# Altium project DCAC.PrjPcb (part 5 of 11)
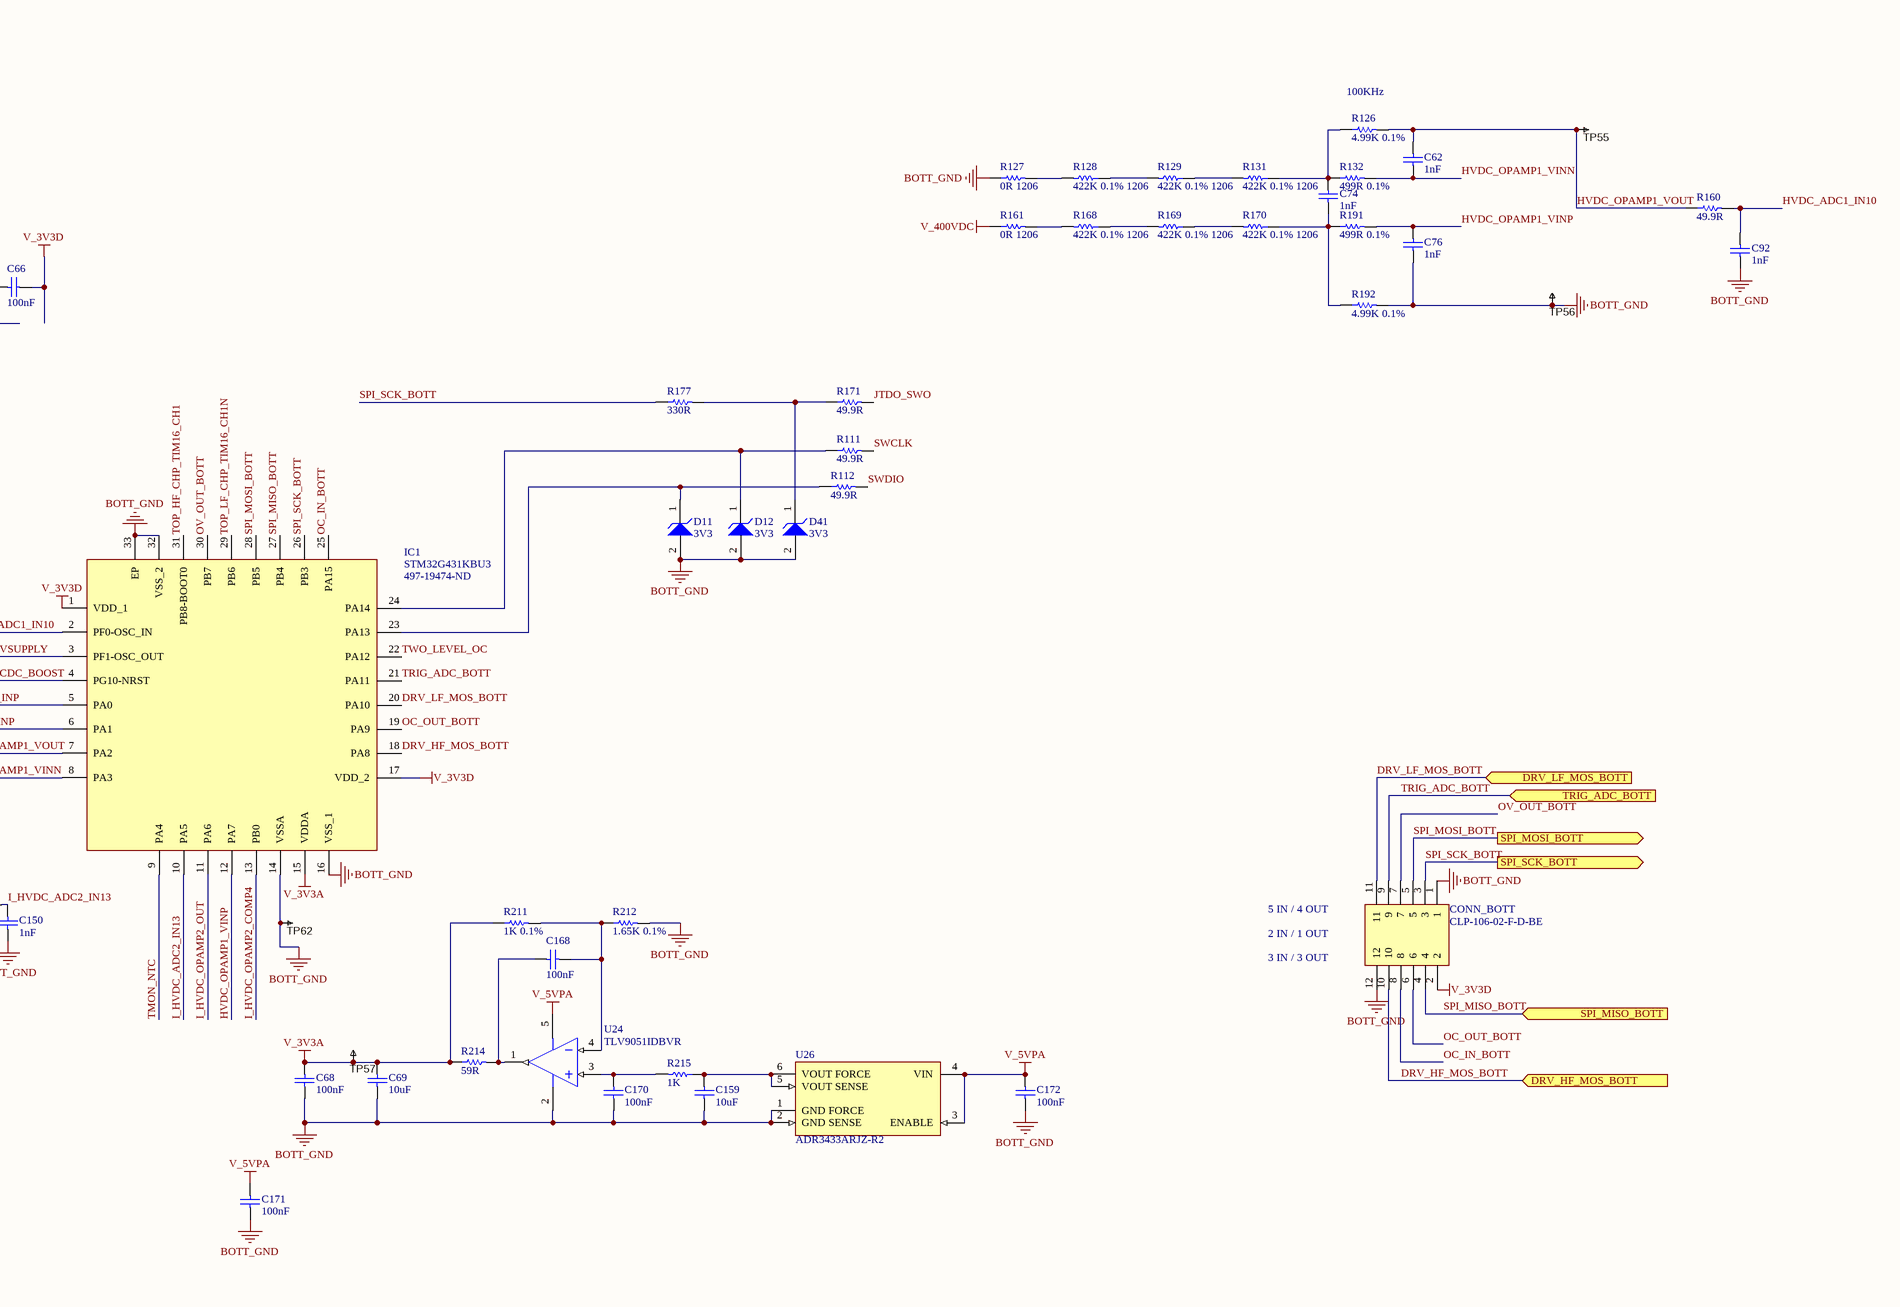
[diagram p15: Control_Sense_BOTT.SchDoc, bottom right]

## Sheet Control_Sense_BOTT.SchDoc (continued)

### Library data of the parts (continued)
R257 = RES-2: Chip Resistor, 0 Ohm, +/- 5%, 0.1 W, -55 to 155 degC, 0603 (1608 Metric), RoHS, Tape and Reel; Manufacturer: Yageo; Manufacturer Part Number: RC0603JR-070RL; Temperature Coefficient: 200ppm/degreesC; Voltage Rating: 50V; Power Rating: 100mW; Resistance: 0mOhm; Width: 0.8mm; Max Operating Temperature: 155degC; Tolerance: 5%; Package Reference: 0603; Height: 0.45mm; Depth: 0.8mm; Package Description: 2-Pin Surface Mount Device, Body 1.6 x 0.8 mm; Termination: SMD/SMT; Package Quantity: 5000; Case/Package: 0603; Case Code (Imperial): 0603; Radiation Hardening: No; Number of Pins: 2; Length: 1.6mm; Lead Free: LeadFree; Voltage Rating (DC): 50V; Military Standard: Not; Datasheet URL: http://www.yageo.com/NewPortal/yageodocoutput?fileName=/pdf/R-Chip/PYu-RC_Group_51_RoHS_L_5.pdf; Manufacturer URL: http://www.yageo.com/; Packaging: TapeandReel; Case Code (Metric): 1608; Min Operating Temperature: -55degC; Composition: ThickFilm; RoHSCompliant: true; Contact Plating: Tin; Datasheet Version: Rev. 5, 10/2016; REACH SVHC: NoSVHC; Supplier 1: Avnet; Supplier Part Number 1: RC0603JR-070RL; RoHS: Yes; Category: Chip SMD Resistors; Stock 1: 1330000; Pricing 1: 5000=0.00138, 10000=0.00136, 20000=0.00132, 30000=0.00129, 40000=0.00124, 50000=0.00121, 500000=0.00118 (USD); Size Code: 0603; Resistor Type: Thick Film; Series: RC; Max Power Dissipation: 100mW; Construction: Rectangular; Number of Terminations: 2; Features: Moisture Resistant; Technology: THICK FILM; Resistance Tolerance: 5%; RoHS Compliant: Yes; ComponentLink1URL: https://datasheet.ciiva.com/11808/pyu-r-int-6-11808700.pdf?src-supplier=RSComponents; ComponentLink1Description: https://datasheet.ciiva.com/11808/pyu-r-int-6-11808700.pdf?src-supplier=RSComponents; ComponentLink2URL: https://datasheet.ciiva.com/22747/443971-22747530.pdf?src-supplier=Element14; ComponentLink2Description: https://datasheet.ciiva.com/22747/443971-22747530.pdf?src-supplier=Element14; ComponentLink3URL: https://datasheet.ciiva.com/12555/rc0603-272842-12555254.pdf?src-supplier=Mouser; ComponentLink3Description: https://datasheet.ciiva.com/12555/rc0603-272842-12555254.pdf?src-supplier=Mouser; ComponentLink4URL: https://datasheet.ciiva.com/7746/1738695-7746421.pdf?src-supplier=Element14; ComponentLink4Description: https://datasheet.ciiva.com/7746/1738695-7746421.pdf?src-supplier=Element14; ComponentLink5URL: https://datasheet.ciiva.com/7746/1738695-7746422.pdf?src-supplier=Element14; ComponentLink5Description: https://datasheet.ciiva.com/7746/1738695-7746422.pdf?src-supplier=Element14; ComponentLink6URL: https://datasheet.ciiva.com/8883/pyu-rc0603-51-rohs-l-4-8883045.pdf?src-supplier=Avnet; ComponentLink6Description: https://datasheet.ciiva.com/8883/pyu-rc0603-51-rohs-l-4-8883045.pdf?src-supplier=Avnet; ComponentLink7URL: https://datasheet.ciiva.com/15189/getdatasheetpartid-329462-15189845.pdf?src-supplier=Verical; ComponentLink7Description: https://datasheet.ciiva.com/15189/getdatasheetpartid-329462-15189845.pdf?src-supplier=Verical
R258 = RES: ±1% ±400ppm/℃ 5.1Ω 0.1W 0603 Chip Resistor - Surface Mount ROHS; Part Number: ERJ3EKF1803V; Manufacturer: Panasonic; Manufacturer Part Number: ERJ-3EKF1803V; Resistance: 180kR; Power Rating: 100mW; Voltage Rating: 75V; Temperature Coefficient: 100ppm/°C; Supplier 1: Digi-Key; Supplier Part Number 1: P180KHCT-ND; RoHS: Yes; Category: Chip SMD Resistors; Stock 1: 113875; Pricing 1: 1=0.10000, 10=0.06100, 100=0.02460, 1000=0.01106, 2500=0.00960 (USD); Mount: Surface Mount; Case/Package: 0603; Case Code (Metric): 1608; Case Code (Imperial): 0603; Contact Plating: Tin; Weight: 7.1E-05oz; Min Operating Temperature: -55°C; Max Operating Temperature: 155°C; Tolerance: 1%; Packaging: Tape and Reel; Resistor Type: Thick Film; Series: ERJ; Package Quantity: 1; Number of Terminations: 2; Termination: SMD/SMT; Max Power Dissipation: 100mW; Voltage Rating (DC): 75V; Construction: Rectangular; Features: Automotive AEC-Q200; Resistance Tolerance: 1%; Length: 1.6mm; Width: 0.031inch; Height: 0.022inch; Depth: 0.8mm; Radiation Hardening: No; RoHS Compliant: Yes; Military Standard: Not; Lead Free: Lead Free; REACH SVHC: No SVHC; ComponentLink1URL: https://datasheet.ciiva.com/22739/426256-22739797.pdf?src-supplier=Element14; ComponentLink1Description: https://datasheet.ciiva.com/22739/426256-22739797.pdf?src-supplier=Element14; ComponentLink2URL: https://datasheet.ciiva.com/24162/aoa0000ce2-24162661.pdf?src-supplier=Mouser; ComponentLink2Description: https://datasheet.ciiva.com/24162/aoa0000ce2-24162661.pdf?src-supplier=Mouser; ComponentLink3URL: https://datasheet.ciiva.com/30137/aoa0000ce2-30137813.pdf?src-supplier=Onlinecomponents.com; ComponentLink3Description: https://datasheet.ciiva.com/30137/aoa0000ce2-30137813.pdf?src-supplier=Onlinecomponents.com; ComponentLink4URL: https://datasheet.ciiva.com/46436/1678782-46436790.pdf?src-supplier=Element14; ComponentLink4Description: https://datasheet.ciiva.com/46436/1678782-46436790.pdf?src-supplier=Element14; ComponentLink5URL: https://datasheet.ciiva.com/46436/1678782-46436791.pdf?src-supplier=Element14; ComponentLink5Description: https://datasheet.ciiva.com/46436/1678782-46436791.pdf?src-supplier=Element14; ComponentLink6URL: https://datasheet.ciiva.com/16782/70260748-16782408.pdf?src-supplier=Allied+Electronics; ComponentLink6Description: https://datasheet.ciiva.com/16782/70260748-16782408.pdf?src-supplier=Allied+Electronics; ComponentLink7URL: https://datasheet.ciiva.com/17207/aoa0000ce2-17207208.pdf?src-supplier=Avnet+Europe; ComponentLink7Description: https://datasheet.ciiva.com/17207/aoa0000ce2-17207208.pdf?src-supplier=Avnet+Europe; ComponentLink8URL: https://datasheet.ciiva.com/28568/1678782-28568699.pdf?src-supplier=Element14; ComponentLink8Description: https://datasheet.ciiva.com/28568/1678782-28568699.pdf?src-supplier=Element14; ComponentLink9URL: https://datasheet.ciiva.com/5915/aoa0000ce2-5915294.pdf?src-supplier=Farnell; ComponentLink9Description: https://datasheet.ciiva.com/5915/aoa0000ce2-5915294.pdf?src-supplier=Farnell; ComponentLink10URL: https://datasheet.ciiva.com/9184/aoa0000ce2-9184911.pdf?src-supplier=Avnet; ComponentLink10Description: https://datasheet.ciiva.com/9184/aoa0000ce2-9184911.pdf?src-supplier=Avnet; Parameter 1: *; JLCPCB Part #: C25197
R262 R263 = CMP-2001-00026-5: ±1% 2kΩ ±100ppm/℃ 0.125W 0805 Chip Resistor - Surface Mount ROHS; Manufacturer: Panasonic; Voltage Rating: 150 V; RoHSCompliant: true; Packaging: Tape and Reel; ComponentLink2Description: Datasheet; DatasheetVersion: 04/2015; Min Operating Temperature: -55 degC; Max Operating Temperature: 155 degC; Mounting Technology: Surface Mount; Length: 2 mm; Package Quantity: 5000; REACH SVHC: Unknown; ComponentLink1URL: http://www.panasonic.com/; ComponentLink2URL: http://industrial.panasonic.com/cdbs/www-data/pdf/RDA0000/AOA0000C86.pdf; Mount: Surface Mount; PackageReference: 0805; ComponentLink1Description: Manufacturer URL; PackageDescription: 2-Pin Surface Mount Device, Body 2 x 1.25 mm; Height: 0.6 mm; JLCPCB Part #: C17604
TP41-TP62 = TESTPOINT: SMD test pin
U3 = TI-LP2951-D8: Single Output LDO, 100 mA, 1.2 to 29 V Output, 2 to 30 V Input, -40 to 125 degC, 8-Pin SOIC (D), RoHS, Tape and Reel; Manufacturer: Texas Instruments; Iq (Typ) (mA): 0.075; Output Options: Adjustable Output; Output Capacitor Type: Non-Ceramic; Vdo (Typ) (mV): 380; Vin (Max) (V): 30; Vout (Min) (V): 1.2; Vin (Min) (V): 2; Rating: Catalog; Accuracy (%): 1.4; Iout (Max) (A): 0.1; Vout (Max) (V): 29; ComponentLink1URL: http://www.ti.com/; PackageReference: D0008A; Operating Temperature Range (C): -40 to 125; ComponentLink3Description: Package Specification; ComponentLink1Description: Manufacturer URL; ComponentLink2URL: http://www.ti.com/lit/ds/symlink/lp2950-30.pdf; DatasheetVersion: SLVS582H; ComponentLink2Description: Datasheet; RoHS: TRUE; Packing: Tape and Reel; PartNumber: LP2951DR; PackageVersion: 4040047-3/M; Mounting Technology: Surface Mount; PackageDescription: 8-Pin Plastic Small Outline, Body 3.9 x 4.9 mm, Pitch 1.27 mm; ComponentLink3URL: http://www.ti.com/lit/ml/msoi002j/msoi002j.pdf
U6 U7 = CMP-0366-01377-2: Adjustable Precision Shunt Regulator, 34 ppm / degC, 100 mA, -40 to 85 degC, 3-pin SOT-89 (PK), Green (RoHS & no Sb/Br); Manufacturer: Texas Instruments; Rating: Military; SubFamily: Shunt Voltage Reference; Min Iz for Regulation(uA): 600; Initial Accuracy @ 25/deg C(%): 2; Temp Coeff(Typ)(ppm/ degree C): 34; Temp Coeff(Max)(ppm/ degree C): 92; VO Adj(Min)(V): 2.495; Iout/Iz(Max)(mA): 100; VO Adj(Max)(V): 36; Eco-Plan: Green (RoHS & no Sb/Br); Code_JEDEC: TO-243; DatasheetVersion: SLVS543M; ComponentLink1URL: http://www.ti.com/; PackageReference: PK0003A; PackageDescription: 3-Pin Plastic Small Outline, Body 2.5 x 4.5 mm, Pitch 1.5 mm; PackageVersion: 4040234/D; ComponentLink3URL: http://www.ti.com/litv/pdf/mhsi001b; PartNumber: TL431IPK; ComponentLink3Description: Package Specification; ComponentLink2URL: http://www.ti.com/general/docs/lit/getliterature.tsp?genericPartNumber=TL431&fileType=pdf; Mounting Technology: Surface Mount; ComponentLink2Description: Datasheet; ComponentLink1Description: Manufacturer URL
U10 U15 = CMP-0859-00394-3: Single 2-Input Positive-AND Gate, DCK0005A, SMALL T&R; Generic Part Number: SN74AHC1G08; Manufacturer: Texas Instruments; Schmitt Trigger: No; ICC @ Nom Voltage(Max)(mA): 0.01; Technology Family: AHC; Output Drive (IOL/IOH)(Max)(mA): 50/-50; tpd @ Nom Voltage(Max)(ns): 12.3,7.9; Logic: True; Gate Type: AND; VCC(Min)(V): 2; Input Type: CMOS; Voltage(Nom)(V): 3.3,5; Bits(#): 1; VCC(Max)(V): 5.5; F @ Nom Voltage(Max)(Mhz): 75; Rating: Catalog; 3-State Output: No; Operating Temperature Range(C): -55 to 125; DatasheetVersion: SCLS314N; Sub-Family: AND Gate; Output Type: CMOS; PackageReference: DCK0005A
U11 U16 = CMP-0859-00258-3: Single Bus Buffer Gate With 3-State Output, DCK0005A, LARGE T&R; Manufacturer: Texas Instruments; Bits(#): 1; 3-State Output: Yes; Input Type: CMOS; VCC(Min)(V): 2; Schmitt Trigger: No; Rating: Catalog; tpd @ Nom Voltage(Max)(ns): 6; Voltage(Nom)(V): 5; Technology Family: AHCT; ICC @ Nom Voltage(Max)(mA): 0.01; Output Drive (IOL/IOH)(Max)(mA): 8/-8; Sub-Family: Non-Inverting Buffer/Driver; VCC(Max)(V): 5.5; F @ Nom Voltage(Max)(Mhz): 75; Logic: True; Generic Part Number: SN74AHCT1G126; Operating Temperature Range(C): -40 to 125; Output Type: CMOS; PackageReference: DCK0005A; DatasheetVersion: SCLS380J
U14 = PM-LINEREG-TC1014-IL5: 50 mA, 100 mA and 150 mA CMOS LDOs with Active-Low Shutdown and Reference Bypass, 5-Pin SOT-23, Extended Temperature, Tape and Reel; PackageVersion: revBB, Aug-2009; Code_IPC: SOT23-5; PackageDescription: 5-Lead Plastic Small Outline Transistor (CT) [SOT-23]; DatasheetVersion: revE, Feb-2007; PackageReference: SOT-23-CT5
U23 = PM-CHP-LM2661M-8: Switched Capacitor Voltage Converter, 8-pin Narrow SOIC, Pb-Free; Manufacturer: Texas Instruments; PackageTopMarking: NSZXTT*LM26*63M; CompType: Switch Caps; PowerWise: N; Code_IPC: SOIC127P600-8; PinCount: 8; ComponentLink1Description: Datasheet URL; PackageReference: D0008A; Code_JEDEC: MS-012-AA; PackageDescription: SOIC Narrow, 4.9 x 3.9 x 1.45mm, 8 Lead, 1.27mm Pitch; ComponentLink1URL: http://www.ti.com/general/docs/lit/getliterature.tsp?genericPartNumber=LM2663&fileType=pdf; RoHS: Y
U24 U34 = CMP-0187-00454-2: 2.8 MHz, 150 Î¼A Op Amp, 5-Pin SOT-23, Extended Temperature Range, Tape and Reel; Code_IPC: SOT23-5; PackageDescription: 5-Lead Plastic Small Outline Transistor (OT) [SOT-23]; PackageReference: SOT-23-OT5; ComponentLink3URL: http://www.microchip.com/stellent/groups/techpub_sg/documents/packagingspec/en012702.pdf; ComponentLink1Description: Manufacturer URL; ComponentLink2URL: http://ww1.microchip.com/downloads/en/DeviceDoc/22145a.pdf; ComponentLink2Description: Datasheet; PackageVersion: revBB, Aug-2009; RevisionNote: URLs added.; ComponentLink1URL: http://www.microchip.com/; DatasheetVersion: revA, Mar-2009; ComponentLink3Description: Package Specification
U26 = ADI-ADR34xx-RJ-6: Micropower, High Accuracy Voltage Reference, 3.3 V Output, 3.5 to 5.5 V Supply, Industrial, 6-pin SOT23 (RJ-6), Reel; Manufacturer: Analog Devices; Ref Out TC (ppm/C): 8; Vout: 3.3V; Min V Supply (V): 3.5; Max V Supply (V): 5.5; PartNumber: ADR3433ARJZ-R2; Mounting Technology: Surface Mount; ComponentLink1URL: http://www.analog.com/en/index.html; ComponentLink1Description: Manufacturer URL; PackageVersion: 121608-A, 12/2008; Operating Temp Range: -40 to 125 degC; Packing: Reel; ComponentLink2Description: Datasheet; PackageDescription: 6-Pin Small Outline Transistor Package, Body 2.9 x 1.6 mm, Pitch 0.95 mm; ComponentLink4Description: URL Link1; ComponentLink3Description: Package Specification; Code_JEDEC: MO-178-AB; DatasheetVersion: Rev. B; PackageReference: RJ-6; ComponentLink4URL: Product URL:http://www.analog.com/en/special-linear-functions/voltage-references/adr3433/products/product.html; ComponentLink3URL: http://www.analog.com/static/imported-files/packages/PKG_PDF/SOT-23(RJ)/RJ_6.pdf; ComponentLink2URL: http://www.analog.com/static/imported-files/data_sheets/ADR3412_ADR3420_ADR3425_ADR3430_ADR3433_ADR3440_ADR3450.pdf
U35 U36 = 1EDN8550B: Single-channel EiceDRIVER™ with true  differential inputs
U37 = CMP-0366-01210-2: Adjustable Precision Shunt Regulator, 34 ppm / degC, 100 mA, -40 to 125 degC, 3-pin SOT-23 (DBZ), Green (RoHS & no Sb/Br); Manufacturer: Texas Instruments; Iout/Iz(Max)(mA): 100; Min Iz for Regulation(uA): 600; SubFamily: Shunt Voltage Reference; Temp Coeff(Typ)(ppm/ degree C): 34; VO Adj(Max)(V): 36; Rating: Catalog; Initial Accuracy @ 25/deg C(%): 1; VO Adj(Min)(V): 2.495; Temp Coeff(Max)(ppm/ degree C): 92; PackageReference: DBZ0003A; ComponentLink1Description: Manufacturer URL; Mounting Technology: Surface Mount; ComponentLink2URL: http://www.ti.com/general/docs/lit/getliterature.tsp?genericPartNumber=TL431A&fileType=pdf; PackageVersion: 4203227/B; ComponentLink2Description: Datasheet; PackageDescription: 3-Pin Plastic Small Outline, Body 2.92 x 1.3 mm, Pitch 0.95 mm; ComponentLink1URL: http://www.ti.com/; Eco-Plan: Green (RoHS & no Sb/Br); Code_JEDEC: TO-236; ComponentLink3URL: http://www.ti.com/litv/pdf/mpds108a; DatasheetVersion: SLVS543M; ComponentLink3Description: Package Specification; PartNumber: TL431AQDBZR
U40 = LM51571QRTERQ1: Integrated Circuit; Manufacturer_Name: Texas Instruments; Datasheet Link: https://www.ti.com/lit/ds/symlink/lm51571-q1.pdf?ts=1617256844020&ref_url=https%253A%252F%252Fwww.ti.com%252Fstore%252Fti%252Fen%252Fp%252Fproduct%252F%253Fp%253DLM51571QRTERQ1; Height: 0.8mm; Manufacturer_Part_Number: LM51571QRTERQ1; Mouser Part Number: 595-LM51571QRTERQ1; Mouser Price/Stock: https://www.mouser.co.uk/ProductDetail/Texas-Instruments/LM51571QRTERQ1?qs=DRkmTr78QATLeGZjuFYyEQ%3D%3D; Arrow Part Number: LM51571QRTERQ1; Arrow Price/Stock: https://www.arrow.com/en/products/lm51571qrterq1/texas-instruments?region=nac

## Sheet IND_CURRENT_SENSE.SchDoc
size A2 portrait; SheetNumber: 2; SheetTotal: 4
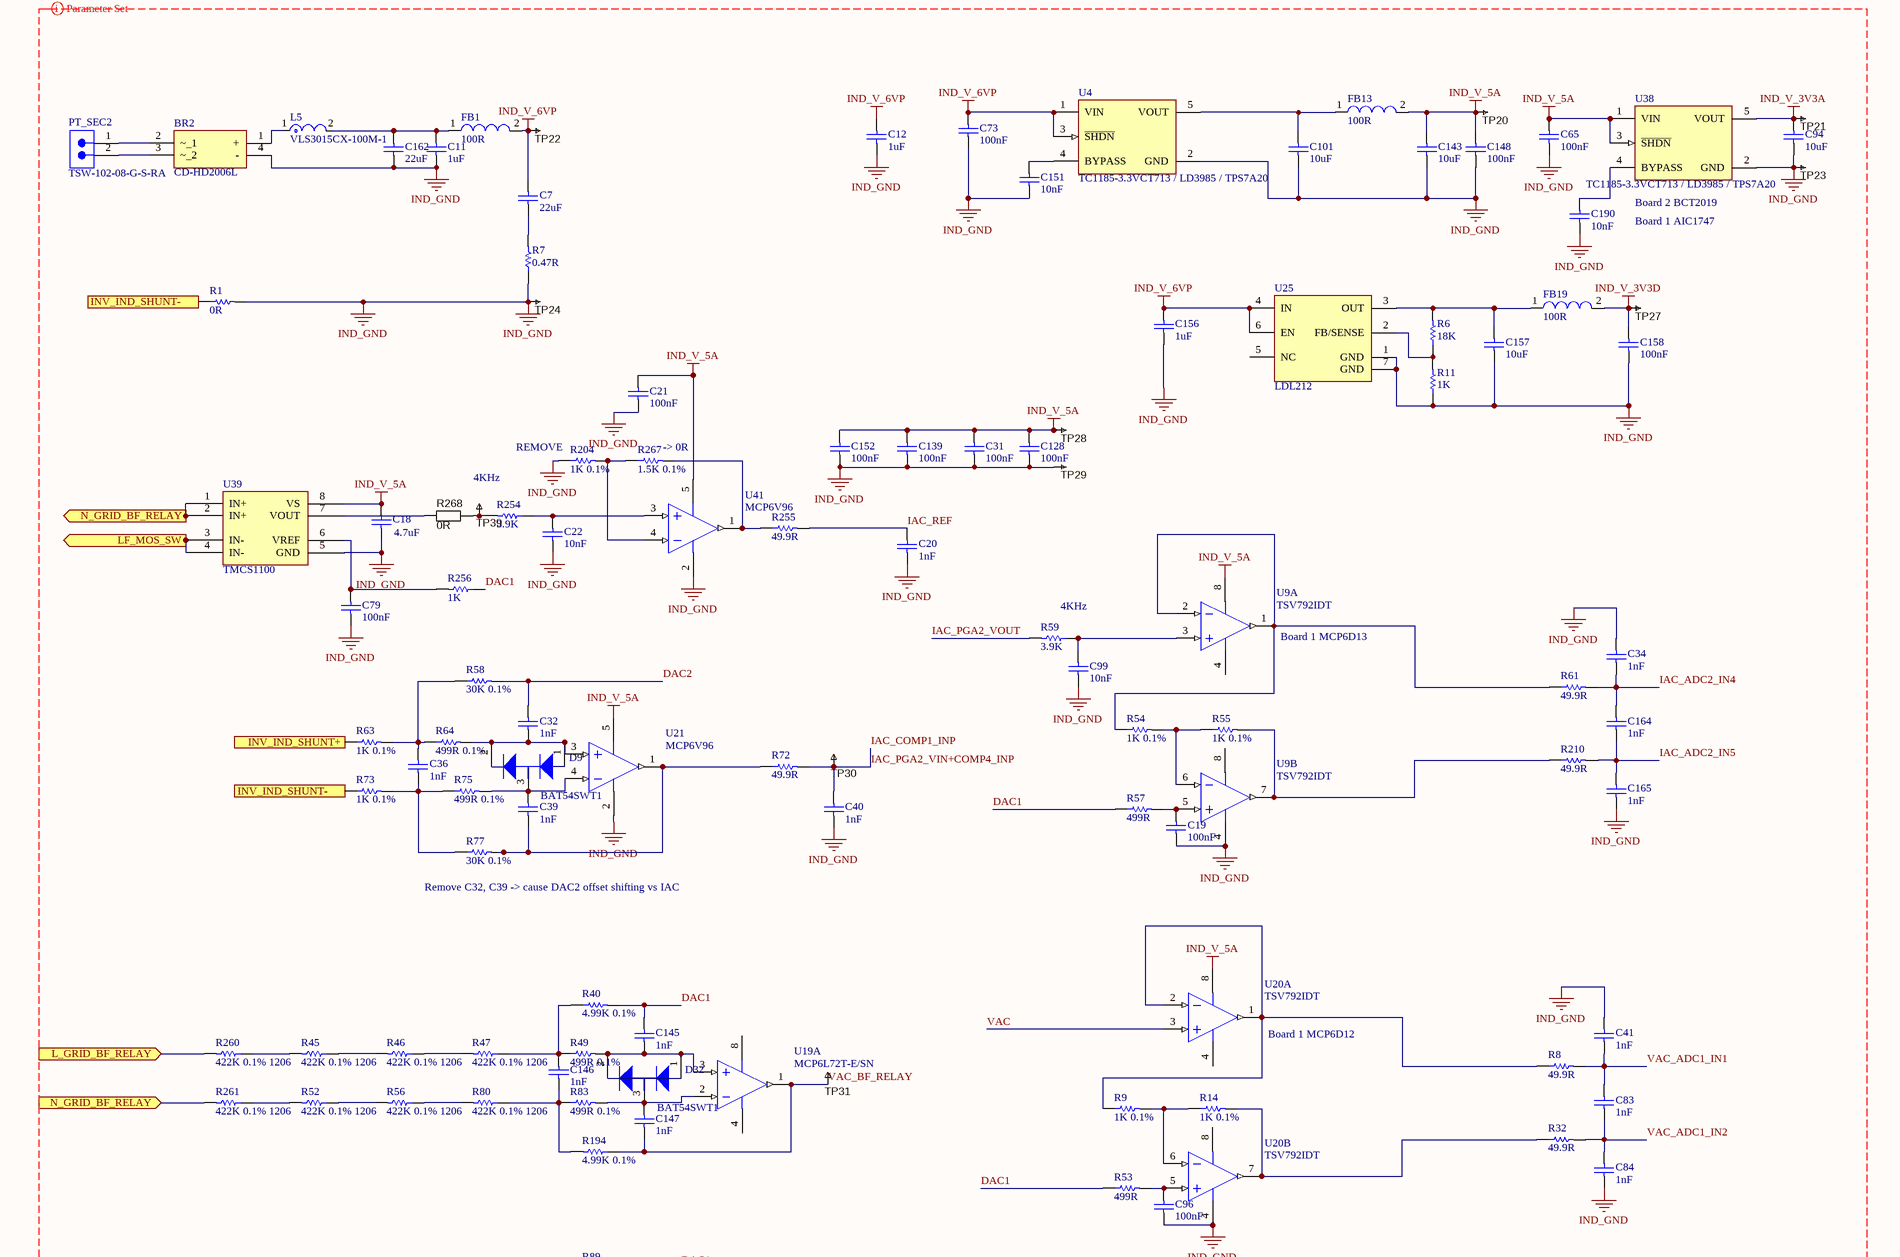
[diagram p6: IND_CURRENT_SENSE.SchDoc, top]
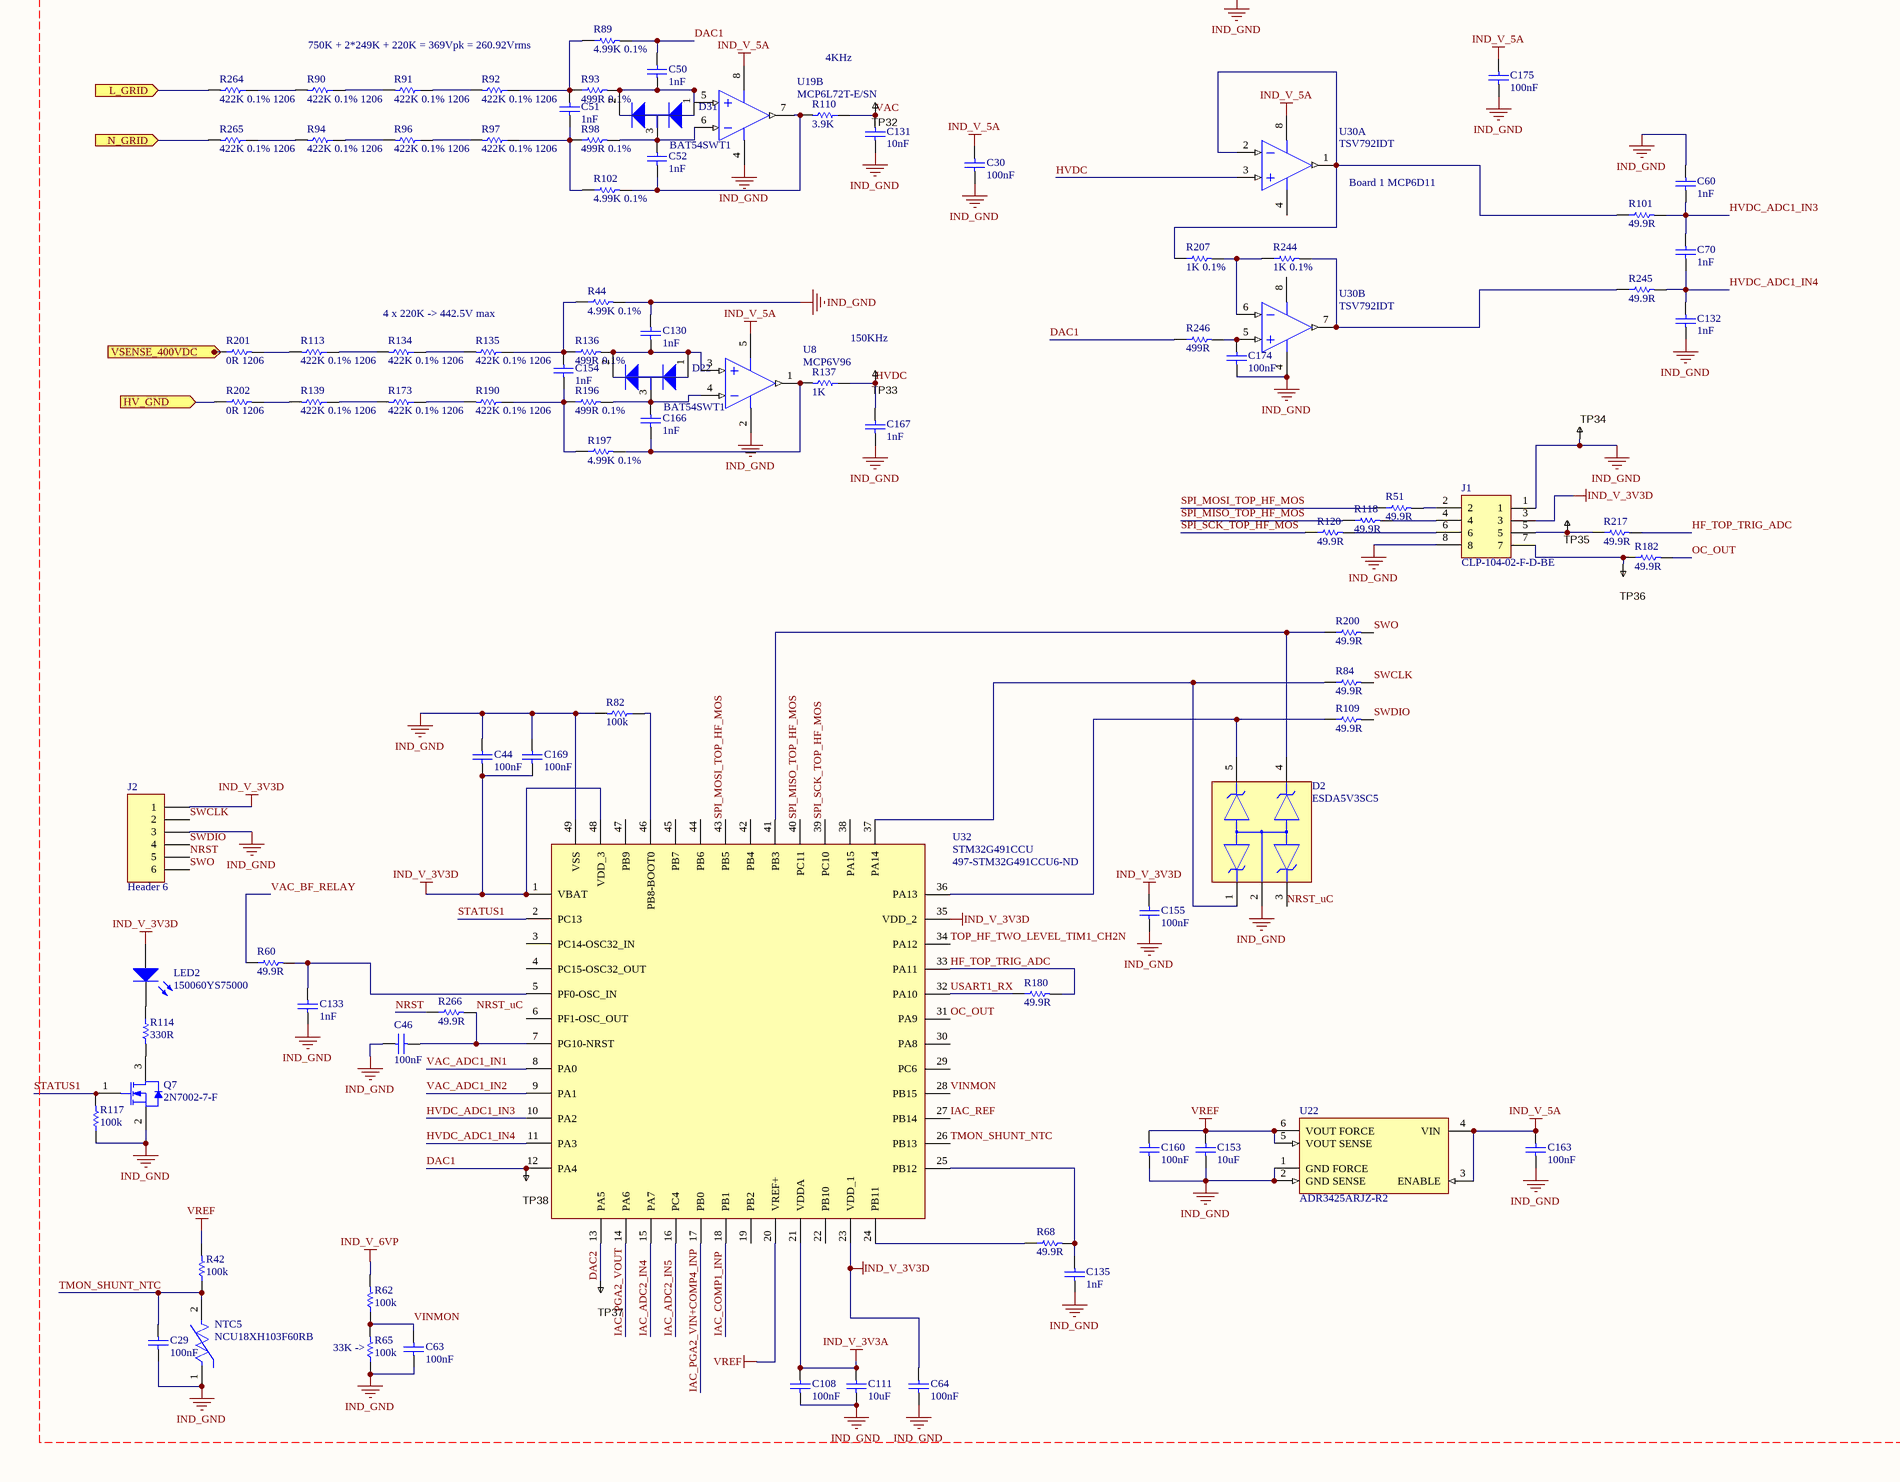
[diagram p7: IND_CURRENT_SENSE.SchDoc, bottom]

### Parts
BR2  CD-HD2006L  [CDHD2006L]
C7  22uF  [CAPC1206(3216)190_N]
C11  1uF  [CAPC1608X86X35NL15T15]
C12  1uF  [CAPC1608X86X35NL15T15]
C18  Capacitance: 4.7uF  [CAPC3216X180X50NL20T25]  (hidden comment: C1206C105K3RACTU)
C19  100nF  [CAPC1608X90X35NL10T15]
C20  1nF  [CAPC1005X56X25NL10T15]
C21  100nF  [CAPC1608X90X35NL10T15]
C22  10nF  [CAPC1608X90X35NL10T15]
C29  100nF  [CAPC1005X56X25NL10T15]
C30  100nF  [CAPC1608X90X35NL10T15]
C31  100nF  [CAPC1608X90X35NL10T15]
C32  1nF  [CAPC1608X90X35NL15T15]
C34  1nF  [CAPC1005X56X25NL10T15]
C36  1nF  [CAPC1608X90X35NL15T15]
C39  1nF  [CAPC1608X90X35NL15T15]
C40  1nF  [CAPC1005X56X25NL10T15]
C41  1nF  [CAPC1005X56X25NL10T15]
C44  100nF  [CAPC1608X90X35NL10T15]
C46  100nF  [CAPC1005X56X25NL10T15]
C50  1nF  [CAPC1608X90X35NL15T15]
C51  1nF  [CAPC1608X90X35NL15T15]
C52  1nF  [CAPC1608X90X35NL15T15]
C60  1nF  [CAPC1005X56X25NL10T15]
C63  100nF  [CAPC1005X56X25NL10T15]
C64  100nF  [CAPC1005X56X25NL10T15]
C65  100nF  [CAPC1608X90X35NL10T15]
C70  1nF  [CAPC1005X56X25NL10T15]
C73  100nF  [CAPC1608X90X35NL10T15]
C79  100nF  [CAPC1608X90X35NL10T15]
C83  1nF  [CAPC1005X56X25NL10T15]
C84  1nF  [CAPC1005X56X25NL10T15]
C94  10uF  [CAPC1608X90X40NL10T20]
C96  100nF  [CAPC1608X90X35NL10T15]
C99  10nF  [CAPC1608X90X35NL10T15]
C101  10uF  [CAPC2013X140X45NL15T25]
C108  100nF  [CAPC1005X56X25NL10T15]
C111  10uF  [CAPC1608X90X40NL10T20]
C128  100nF  [CAPC1608X90X35NL10T15]
C130  1nF  [CAPC1608X90X35NL15T15]
C131  10nF  [CAPC1608X90X35NL10T15]
C132  1nF  [CAPC1005X56X25NL10T15]
C133  1nF  [CAPC1005X56X25NL10T15]
C135  1nF  [CAPC1005X56X25NL10T15]
C139  100nF  [CAPC1608X90X35NL10T15]
C143  10uF  [CAPC2013X140X45NL15T25]
C145  1nF  [CAPC1608X90X35NL15T15]
C146  1nF  [CAPC1608X90X35NL15T15]
C147  1nF  [CAPC1608X90X35NL15T15]
C148  100nF  [CAPC1608X90X35NL10T15]
C151  10nF  [CAPC1608X90X35NL10T15]
C152  100nF  [CAPC1608X90X35NL10T15]
C153  10uF  [CAPC1608X90X40NL10T20]
C154  1nF  [CAPC1608X90X35NL15T15]
C155  100nF  [CAPC1608X90X35NL10T15]
C156  1uF  [CAPC1608X86X35NL15T15]
C157  10uF  [CAPC1608X90X40NL10T20]
C158  100nF  [CAPC1608X90X35NL10T15]
C160  100nF  [CAPC1005X56X25NL10T15]
C162  22uF  [CAPC1206(3216)190_N]
C163  100nF  [CAPC1608X90X35NL10T15]
C164  1nF  [CAPC1005X56X25NL10T15]
C165  1nF  [CAPC1005X56X25NL10T15]
C166  1nF  [CAPC1608X90X35NL15T15]
C167  1nF  [CAPC1608X90X35NL15T15]
C169  100nF  [CAPC1608X90X35NL10T15]
C174  100nF  [CAPC1608X90X35NL10T15]
C175  100nF  [CAPC1608X90X35NL10T15]
C190  10nF  [CAPC1608X90X35NL10T15]
D2  ESDA5V3SC5  [FP-SOT323-5L-MFG]
D9  BAT54SWT1  [ONSC-SOT-323-3-419-04_V]
D22  BAT54SWT1  [ONSC-SOT-323-3-419-04_V]
D31  BAT54SWT1  [ONSC-SOT-323-3-419-04_V]
D32  BAT54SWT1  [ONSC-SOT-323-3-419-04_V]
FB1  100R  [SMD-0603]
FB13  100R  [SMD-0603]
FB19  100R  [SMD-0603]
J1  CLP-104-02-F-D-BE  [CLP-104-02-XXX-D-BE]
J2  Header 6  [HDR1X6]
L5  VLS3015CX-100M-1  [FP-VLS3015CX-H-MFG]
LED2  150060YS75000  [0603_A]
NTC5  NCU18XH103F60RB  [FP-NCU18-0_15-MFG]
PT_SEC2  TSW-102-08-G-S-RA  [SMTC-TSW-102-08-X-S-RA]
Q7  2N7002-7-F  [DIOD-SOT23-3_V]
R1  0R  [RESC1608X55X25ML10T15]
R6  18K  [RESC1608X55X30NL20T20]
R7  0.47R  [RESC1608X55X25NL10T15]
R8  49.9R  [RESC1005X40X25NL05T05]
R9  1K 0.1%  [RESC1608X55X25NL10T15]
R11  1K  [RESC1608X55X30NL15T15]
R14  1K 0.1%  [RESC1608X55X25NL10T15]
R32  49.9R  [RESC1005X40X25NL05T05]
R40  4.99K 0.1%  [RESC1608X55X30NL20T20]
R42  100k  [RESC1608X55X30NL15T15]
R44  4.99K 0.1%  [RESC1608X55X30NL20T20]
R45  422K 0.1% 1206  [RESC1206(3216)_N]
R46  422K 0.1% 1206  [RESC1206(3216)_N]
R47  422K 0.1% 1206  [RESC1206(3216)_N]
R49  499R 0.1%  [RESC1608X55X30LL20T20]
R51  49.9R  [RESC1005X40X25NL05T05]
R52  422K 0.1% 1206  [RESC1206(3216)_N]
R53  499R  [RESC1608X55X25NL10T15]
R54  1K 0.1%  [RESC1608X55X25NL10T15]
R55  1K 0.1%  [RESC1608X55X25NL10T15]
R56  422K 0.1% 1206  [RESC1206(3216)_N]
R57  499R  [RESC1608X55X25NL10T15]
R58  30K 0.1%  [RESC1608X55N]
R59  3.9K  [RESC1608X55X30NL15T15]
R60  49.9R  [RESC1005X40X25NL05T05]
R61  49.9R  [RESC1005X40X25NL05T05]
R62  100k  [RESC1608X55X30NL15T15]
R63  1K 0.1%  [RESC1608X55X25NL10T15]
R64  499R 0.1%  [RESC1608X55N]
R65  100k  [RESC1608X55X30NL15T15]
R68  49.9R  [RESC1005X40X25NL05T05]
R72  49.9R  [RESC1005X40X25NL05T05]
R73  1K 0.1%  [RESC1608X55X25NL10T15]
R75  499R 0.1%  [RESC1608X55N]
R77  30K 0.1%  [RESC1608X55N]
R80  422K 0.1% 1206  [RESC1206(3216)_N]
R82  100k  [RESC1608X55X30NL15T15]
R83  499R 0.1%  [RESC1608X55X30LL20T20]
R84  49.9R  [RESC1005X40X25NL05T05]
R89  4.99K 0.1%  [RESC1608X55X30NL20T20]
R90  422K 0.1% 1206  [RESC1206(3216)_N]
R91  422K 0.1% 1206  [RESC1206(3216)_N]
R92  422K 0.1% 1206  [RESC1206(3216)_N]
R93  499R 0.1%  [RESC1608X55X30LL20T20]
R94  422K 0.1% 1206  [RESC1206(3216)_N]
R96  422K 0.1% 1206  [RESC1206(3216)_N]
R97  422K 0.1% 1206  [RESC1206(3216)_N]
R98  499R 0.1%  [RESC1608X55X30LL20T20]
R101  49.9R  [RESC1005X40X25NL05T05]
R102  4.99K 0.1%  [RESC1608X55X30NL20T20]
R109  49.9R  [RESC1005X40X25NL05T05]
R110  3.9K  [RESC1608X55X30NL15T15]
R113  422K 0.1% 1206  [RESC1206(3216)_N]
R114  330R  [RESC1608X55X25NL10T15]
R117  100k  [RESC1608X55X30NL15T15]
R118  49.9R  [RESC1005X40X25NL05T05]
R120  49.9R  [RESC1005X40X25NL05T05]
R134  422K 0.1% 1206  [RESC1206(3216)_N]
R135  422K 0.1% 1206  [RESC1206(3216)_N]
R136  499R 0.1%  [RESC1608X55X30LL20T20]
R137  1K  [RESC1608X55X30NL15T15]
R139  422K 0.1% 1206  [RESC1206(3216)_N]
R173  422K 0.1% 1206  [RESC1206(3216)_N]
R180  49.9R  [RESC1005X40X25NL05T05]
R182  49.9R  [RESC1005X40X25NL05T05]
R190  422K 0.1% 1206  [RESC1206(3216)_N]
R194  4.99K 0.1%  [RESC1608X55X30NL20T20]
R196  499R 0.1%  [RESC1608X55X30LL20T20]
R197  4.99K 0.1%  [RESC1608X55X30NL20T20]
R200  49.9R  [RESC1005X40X25NL05T05]
R201  0R 1206  [RESC3216X70X50NL05T20]
R202  0R 1206  [RESC3216X70X50NL05T20]
R204  1K 0.1%  [RESC1608X55X25NL10T15]
R207  1K 0.1%  [RESC1608X55X25NL10T15]
R210  49.9R  [RESC1005X40X25NL05T05]
R217  49.9R  [RESC1005X40X25NL05T05]
R244  1K 0.1%  [RESC1608X55X25NL10T15]
R245  49.9R  [RESC1005X40X25NL05T05]
R246  499R  [RESC1608X55X25NL10T15]
R254  3.9K  [RESC1608X55X30NL15T15]
R255  49.9R  [RESC1608X55X30NL15T15]
R256  1K  [RESC1608X55X30NL15T15]
R260  422K 0.1% 1206  [RESC3216X70X40ML20T20]
R261  422K 0.1% 1206  [RESC3216X70X40ML20T20]
R264  422K 0.1% 1206  [RESC3216X70X40ML20T20]
R265  422K 0.1% 1206  [RESC3216X70X40ML20T20]
R266  49.9R  [RESC1005X40X25NL05T05]
R267  1.5K 0.1%  [RESC1608X55X25NL10T15]
R268  value 0R  [RESC1608X55N]  (hidden comment: Thick Film)
TP20  TESTPOINT  [TP-R60]  (value not drawn)  (no BOM)
TP21  TESTPOINT  [TP-R60]  (value not drawn)  (no BOM)
TP22  TESTPOINT  [TP-R60]  (value not drawn)  (no BOM)
TP23  TESTPOINT  [TP-R60]  (value not drawn)  (no BOM)
TP24  TESTPOINT  [TP-R60]  (value not drawn)  (no BOM)
TP27  TESTPOINT  [TP-R60]  (value not drawn)  (no BOM)
TP28  TESTPOINT  [TP-R60]  (value not drawn)  (no BOM)
TP29  TESTPOINT  [TP-R60]  (value not drawn)  (no BOM)
TP30  TESTPOINT  [TP-R60]  (value not drawn)  (no BOM)
TP31  TESTPOINT  [TP-R60]  (value not drawn)  (no BOM)
TP32  TESTPOINT  [TP-R60]  (value not drawn)  (no BOM)
TP33  TESTPOINT  [TP-R60]  (value not drawn)  (no BOM)
TP34  TESTPOINT  [TP-R60]  (value not drawn)  (no BOM)
TP35  TESTPOINT  [TP-R60]  (value not drawn)  (no BOM)
TP36  TESTPOINT  [TP-R60]  (value not drawn)  (no BOM)
TP37  TESTPOINT  [TP-R60]  (value not drawn)  (no BOM)
TP38  TESTPOINT  [TP-R60]  (value not drawn)  (no BOM)
TP39  TESTPOINT  [TP-R60]  (value not drawn)  (no BOM)
U4  TC1185-3.3VCT713 / LD3985 / TPS7A20  [SOT23-5]
U8  MCP6V96  [SOT23-5]
U9  TSV792IDT  [SOP65P490X109-8N]  (parts A,B of 2)
U19  MCP6L72T-E/SN  [SOIC127P600X175-8AN]  (parts A,B of 2)
U20  TSV792IDT  [SOP65P490X109-8N]  (parts A,B of 2)
U21  MCP6V96  [SOT23-5]
U22  ADR3425ARJZ-R2  [SOT23-6]
U25  LDL212  [LDL212PUR]
U30  TSV792IDT  [SOP65P490X109-8N]  (parts A,B of 2)
U32  STM32G491CCU  Supplier Part Number 1: 497-STM32G491CCU6-ND  [QFN50P700X700X65-49N-D]
U38  TC1185-3.3VCT713 / LD3985 / TPS7A20  [SOT23-5]
U39  TMCS1100  [SOIC127P600X175-8AN]
U41  MCP6V96  [SOT23-5]

### Ports
HV_GND (in), INV_IND_SHUNT+ (in), INV_IND_SHUNT- (in), L_GRID (in), L_GRID_BF_RELAY (in), LF_MOS_SW (out), N_GRID (in), N_GRID_BF_RELAY (in), N_GRID_BF_RELAY (out), VSENSE_400VDC (in)

### Nets
BOTT_GND: R202.1 ; port HV_GND
IND_GND: BR2.4(-) C11.1 C12.1 C18.1 C19.1 C20.1 C21.1 C22.1 C29.1 C30.1 C31.1 C34.2 C40.1 C41.2 C44.2 C46.2 C60.2 C63.1 C64.1 C65.1 C73.1 C79.1 C84.1 C94.1 C96.1 C99.1 C101.1 C108.1 C111.1 C128.1 C130.2 C131.1 C132.1 C133.1 C135.1 C139.1 C143.1 C148.1 C151.1 C152.1 C153.1 C155.1 C156.1 C157.1 C158.1 C160.1 C162.1 C163.1 C165.1 C167.1 C169.2 C174.1 C175.1 C190.1 D2.2(COMMON_ANODE) J1.1 J1.8 J2.3 NTC5.1 Q7.2(S) R1.2 R7.1 R11.1 R44.2 R65.1 R82.2 R117.1 R204.1 TP23.1 TP24.1 TP29.1 TP34.1 U4.2(GND) U8.2(VSS) U9.4(-VS) U19.4(VSS) U20.4(-VS) U21.2(VSS) U22.1(GND_FORCE) U22.2(GND_SENSE) U25.1(GND) U25.7(GND) U30.4(-VS) U32.49(VSS) U38.2(GND) U39.5(GND) U41.2(VSS)
IND_V_3V3A: C94.2 C108.2 C111.2 TP21.1 U32.21(VDDA) U38.5(VOUT)
IND_V_3V3D: C44.1 C64.2 C155.2 C158.2 C169.1 FB19.2 J1.3 J2.1 LED2.2(A) TP27.1 U32.1(VBAT) U32.23(VDD_1) U32.35(VDD_2) U32.48(VDD_3)
IND_V_5A: C18.2 C21.2 C30.2 C31.2 C65.2 C128.2 C139.2 C143.2 C148.2 C152.2 C163.2 C175.2 FB13.2 TP20.1 TP28.1 U8.5(VDD) U9.8(+VS) U19.8(VDD) U20.8(+VS) U21.5(VDD) U22.3(ENABLE) U22.4(VIN) U30.8(+VS) U38.1(VIN) U38.3(~{SHDN}) U39.8(VS) U41.5(VDD)
IND_V_6VP: C7.2 C12.2 C73.2 C156.2 FB1.2 R62.2 TP22.1 U4.1(VIN) U4.3(~{SHDN}) U25.4(IN) U25.6(EN)
TOP_LF_GND: U39.3(IN-) U39.4(IN-) ; port LF_MOS_SW
V_400VDC: R201.1 ; port VSENSE_400VDC
VREF: C153.2 C160.2 R42.2 U22.5(VOUT_SENSE) U22.6(VOUT_FORCE) U32.20(VREF+)
DAC1: C50.2 C145.2 R40.2 R53.1 R57.1 R89.2 R246.1 R256.1 TP38.1 U32.12(PA4)  [project net DAC1_2]
DAC2: C32.2 R58.2 TP37.1 U32.13(PA5)  [project net DAC2_2]
HF_TOP_TRIG_ADC: R180.2 R217.2 U32.33(PA11)  [project net HF_TOP_TRIG_ADC_2]
HVDC: C167.2 R137.1 TP33.1 U30.3(+IN_1)  [project net HVDC_2]
HVDC_ADC1_IN3: C60.1 C70.2 R101.2 U32.10(PA2)  [project net HVDC_ADC1_IN3_2]
HVDC_ADC1_IN4: C70.1 C132.2 R245.2 U32.11(PA3)  [project net HVDC_ADC1_IN4_2]
IAC_ADC2_IN4: C34.1 C164.2 R61.2 U32.15(PA7)  [project net IAC_ADC2_IN4_2]
IAC_ADC2_IN5: C164.1 C165.2 R210.2 U32.16(PC4)  [project net IAC_ADC2_IN5_2]
IAC_COMP1_INP: C40.2 R72.2 TP30.1 U32.17(PB0) U32.18(PB1)  [also labelled IAC_PGA2_VIN+COMP4_INP]  [project net IAC_COMP1_INP_2]
IAC_PGA2_VOUT: R59.2 U32.14(PA6)  [project net IAC_PGA2_VOUT_2]
IAC_REF: C20.2 R255.2 U32.27(PB14)  [project net IAC_REF_2]
INV_IND_SHUNT+: R63.1 ; port INV_IND_SHUNT+
INV_IND_SHUNT-: R1.1 R73.1 R260.2 ; port INV_IND_SHUNT-, port L_GRID_BF_RELAY
L_GRID: R264.2 ; port L_GRID
N_GRID: R265.2 ; port N_GRID
N_GRID_BF_RELAY: R261.2 U39.1(IN+) U39.2(IN+) ; port N_GRID_BF_RELAY
NRST: J2.5 R266.1  [project net NRST_2]
NRST_uC: C46.1 D2.3(2_CATHODE) R266.2 U32.7(PG10-NRST)  [project net NRST_uC_2]
OC_OUT: R182.2 U32.31(PA9)  [project net OC_OUT_2]
SPI_MISO_TOP_HF_MOS: R118.1 U32.40(PC11)  [project net SPI_MISO_TOP_HF_MOS_2]
SPI_MOSI_TOP_HF_MOS: R51.1 U32.43(PB5)  [project net SPI_MOSI_TOP_HF_MOS_2]
SPI_SCK_TOP_HF_MOS: R120.1 U32.39(PC10)  [project net SPI_SCK_TOP_HF_MOS_2]
STATUS1: Q7.1(G) R117.2 U32.2(PC13)  [project net STATUS1_2]
SWCLK: J2.2 R84.2  [project net SWCLK_2]
SWDIO: J2.4 R109.2  [project net SWDIO_2]
SWO: J2.6 R200.2  [project net SWO_2]
TMON_SHUNT_NTC: C29.2 NTC5.2 R42.1 U32.26(PB13)  [project net TMON_SHUNT_NTC_2]
TOP_HF_TWO_LEVEL_TIM1_CH2N: U32.34(PA12)  [project net TOP_HF_TWO_LEVEL_TIM1_CH2N_2]
USART1_RX: R180.1 U32.32(PA10)  [project net USART1_RX_2]
VAC: C131.2 R110.1 TP32.1 U20.3(+IN_1)  [project net VAC_2]
VAC_ADC1_IN1: C41.1 C83.2 R8.2 U32.8(PA0)  [project net VAC_ADC1_IN1_2]
VAC_ADC1_IN2: C83.1 C84.2 R32.2 U32.9(PA1)  [project net VAC_ADC1_IN2_2]
VAC_BF_RELAY: C147.2 R60.1 R194.1 TP31.1 U19.1(VOUTA)  [project net VAC_BF_RELAY_2]
VINMON: C63.2 R62.1 R65.2 U32.28(PB15)  [project net VINMON_2]
NetBR2_1: BR2.1(+) L5.1
NetBR2_2: BR2.2(~_1) PT_SEC2.1
NetBR2_3: BR2.3(~_2) PT_SEC2.2
NetC7_1: C7.1 R7.2
NetC11_2: C11.2 C162.2 FB1.1 L5.2
NetC19_2: C19.2 R57.2 U9.5(+IN_2)
NetC22_2: C22.2 R254.1 U41.3(VIN+)
NetC32_1: C32.1 D9.1(A) D9.2(K) R64.2 U21.3(VIN+)
NetC36_1: C36.1 R73.2 R75.1 R77.1
NetC36_2: C36.2 R58.1 R63.2 R64.1
NetC39_1: C39.1 D9.3(K/A) R75.2 U21.4(VIN-)
NetC39_2: C39.2 R72.1 R77.2 U21.1(VOUT)
NetC50_1: C50.1 D31.1(A) D31.2(K) R93.2 U19.5(VINB+)
NetC51_1: C51.1 R97.1 R98.1 R102.1
NetC51_2: C51.2 R89.1 R92.1 R93.1
NetC52_1: C52.1 D31.3(K/A) R98.2 U19.6(VINB-)
NetC52_2: C52.2 R102.2 R110.2 U19.7(VOUTB)
NetC79_2: C79.2 R256.2 U39.6(VREF)
NetC96_2: C96.2 R53.2 U20.5(+IN_2)
NetC99_2: C99.2 R59.1 U9.3(+IN_1)
NetC101_2: C101.2 FB13.1 U4.5(VOUT)
NetC130_1: C130.1 D22.1(A) D22.2(K) R136.2 U8.3(VIN+)
NetC133_2: C133.2 R60.2 U32.5(PF0-OSC_IN)
NetC135_2: C135.2 R68.2 U32.25(PB12)
NetC145_1: C145.1 D32.1(A) D32.2(K) R49.2 U19.3(VINA+)
NetC146_1: C146.1 R80.1 R83.1 R194.2
NetC146_2: C146.2 R40.1 R47.1 R49.1
NetC147_1: C147.1 D32.3(K/A) R83.2 U19.2(VINA-)
NetC151_2: C151.2 U4.4(BYPASS)
NetC154_1: C154.1 R190.1 R196.1 R197.1
NetC154_2: C154.2 R44.1 R135.1 R136.1
NetC157_2: C157.2 FB19.1 R6.2 U25.3(OUT)
NetC166_1: C166.1 D22.3(K/A) R196.2 U8.4(VIN-)
NetC166_2: C166.2 R137.2 R197.2 U8.1(VOUT)
NetC174_2: C174.2 R246.2 U30.5(+IN_2)
NetC190_2: C190.2 U38.4(BYPASS)
NetD2_1: D2.1(1_CATHODE) R84.1 U32.37(PA14)
NetD2_4: D2.4(3_CATHODE) R200.1 U32.41(PB3)
NetD2_5: D2.5(4_CATHODE) R109.1 U32.36(PA13)
NetJ1_2: J1.2 R51.2
NetJ1_4: J1.4 R118.2
NetJ1_5: J1.5 R217.1 TP35.1
NetJ1_6: J1.6 R120.2
NetJ1_7: J1.7 R182.1 TP36.1
NetLED2_1: LED2.1(K) R114.1
NetQ7_3: Q7.3(D) R114.2
NetR6_1: R6.1 R11.2 U25.2(FB/SENSE)
NetR8_1: R8.1 R9.1 U20.1(OUT_1) U20.2(-IN_1)
NetR9_2: R9.2 R14.1 U20.6(-IN_2)
NetR14_2: R14.2 R32.1 U20.7(OUT_2)
NetR45_1: R45.1 R46.2
NetR45_2: R45.2 R260.1
NetR46_1: R46.1 R47.2
NetR52_1: R52.1 R56.2
NetR52_2: R52.2 R261.1
NetR54_1: R54.1 R61.1 U9.1(OUT_1) U9.2(-IN_1)
NetR54_2: R54.2 R55.1 U9.6(-IN_2)
NetR55_2: R55.2 R210.1 U9.7(OUT_2)
NetR56_1: R56.1 R80.2
NetR68_1: R68.1 U32.24(PB11)
NetR82_1: R82.1 U32.46(PB8-BOOT0)
NetR90_1: R90.1 R91.2
NetR90_2: R90.2 R264.1
NetR91_1: R91.1 R92.2
NetR94_1: R94.1 R96.2
NetR94_2: R94.2 R265.1
NetR96_1: R96.1 R97.2
NetR101_1: R101.1 R207.1 U30.1(OUT_1) U30.2(-IN_1)
NetR113_1: R113.1 R134.2
NetR113_2: R113.2 R201.2
NetR134_1: R134.1 R135.2
NetR139_1: R139.1 R173.2
NetR139_2: R139.2 R202.2
NetR173_1: R173.1 R190.2
NetR204_2: R204.2 R267.1 U41.4(VIN-)
NetR207_2: R207.2 R244.1 U30.6(-IN_2)
NetR244_2: R244.2 R245.1 U30.7(OUT_2)
NetR254_2: R254.2 R268.2 TP39.1
NetR255_1: R255.1 R267.2 U41.1(VOUT)
NetR268_1: R268.1 U39.7(VOUT)

Not connected (* = marked no-connect by the designer): U25 5(NC); U32 3(PC14-OSC32_IN) 4(PC15-OSC32_OUT) 6(PF1-OSC_OUT) 19(PB2) 22(PB10) 29(PC6) 30(PA8) 38(PA15) 42(PB4) 44(PB6) 45(PB7) 47(PB9)

### Layout directives
net class IND: DAC1, DAC2, HF_TOP_TRIG_ADC, HVDC, HVDC_ADC1_IN3, HVDC_ADC1_IN4, IAC_ADC2_IN4, IAC_ADC2_IN5, IAC_COMP1_INP, IAC_PGA2_VIN+COMP4_INP, IAC_PGA2_VOUT, IAC_REF, IND_GND, IND_V_3V3A, IND_V_3V3D, IND_V_5A, IND_V_6VP, NRST, NRST_uC, OC_OUT, SPI_MISO_TOP_HF_MOS, SPI_MOSI_TOP_HF_MOS, SPI_SCK_TOP_HF_MOS, STATUS1, SWCLK, SWDIO, SWO, TMON_SHUNT_NTC, TOP_HF_TWO_LEVEL_TIM1_CH2N, USART1_RX, VAC, VAC_ADC1_IN1, VAC_ADC1_IN2, VAC_BF_RELAY, VINMON, VREF

### Notes on the sheet
- (near U38) Board 2 BCT2019
- Board 1 AIC1747
- 4KHz
- (near R204) REMOVE
- (near R267) -> 0R
- (near R59) 4KHz
- (near U9) Board 1 MCP6D13
- (near R77) Remove C32, C39 -> cause DAC2 offset shifting vs IAC
- (near U20) Board 1 MCP6D12
- 750K + 2*249K + 220K = 369Vpk = 260.92Vrms
- (near U30) Board 1 MCP6D11
- 4 x 220K -> 442.5V max
- 150KHz
- (near R65) 33K ->